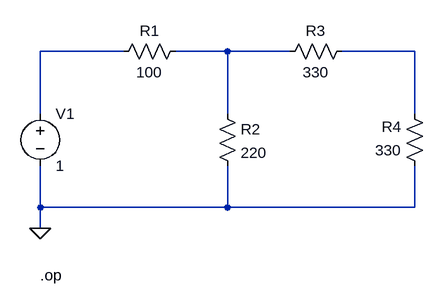
[diagram p0: schematic Kirchhoff.asc]
Kirchhoff.asc, the LTspice schematic file:
Version 4
SHEET 1 880 680
WIRE 80 176 -48 176
WIRE 240 176 160 176
WIRE 336 176 240 176
WIRE 528 176 416 176
WIRE -48 272 -48 176
WIRE 240 272 240 176
WIRE 528 272 528 176
WIRE -48 416 -48 352
WIRE 240 416 240 352
WIRE 240 416 -48 416
WIRE 528 416 528 352
WIRE 528 416 240 416
WIRE -48 448 -48 416
FLAG -48 448 0
DATAFLAG 240 176 "$"
DATAFLAG 528 176 "$"
SYMBOL voltage -48 256 R0
SYMATTR InstName V1
SYMATTR Value 1
SYMBOL res 176 160 R90
WINDOW 0 0 56 VBottom 2
WINDOW 3 32 56 VTop 2
SYMATTR InstName R1
SYMATTR Value 100
SYMBOL res 224 256 R0
SYMATTR InstName R2
SYMATTR Value 220
SYMBOL res 432 160 R90
WINDOW 0 0 56 VBottom 2
WINDOW 3 32 56 VTop 2
SYMATTR InstName R3
SYMATTR Value 330
SYMBOL res 544 368 R180
WINDOW 0 36 76 Left 2
WINDOW 3 36 40 Left 2
SYMATTR InstName R4
SYMATTR Value 330
TEXT -48 520 Left 2 !.op

The netlist it stands for:
* Kirchhoff.asc
V1 N001 0 1
R1 N002 N001 100
R2 N002 0 220
R3 N003 N002 330
R4 0 N003 330
.op
.backanno
.end